# Altium schematic sheet PCB_Block_diagram.SchDoc
size A4; SheetNumber: 1; SheetTotal: 9
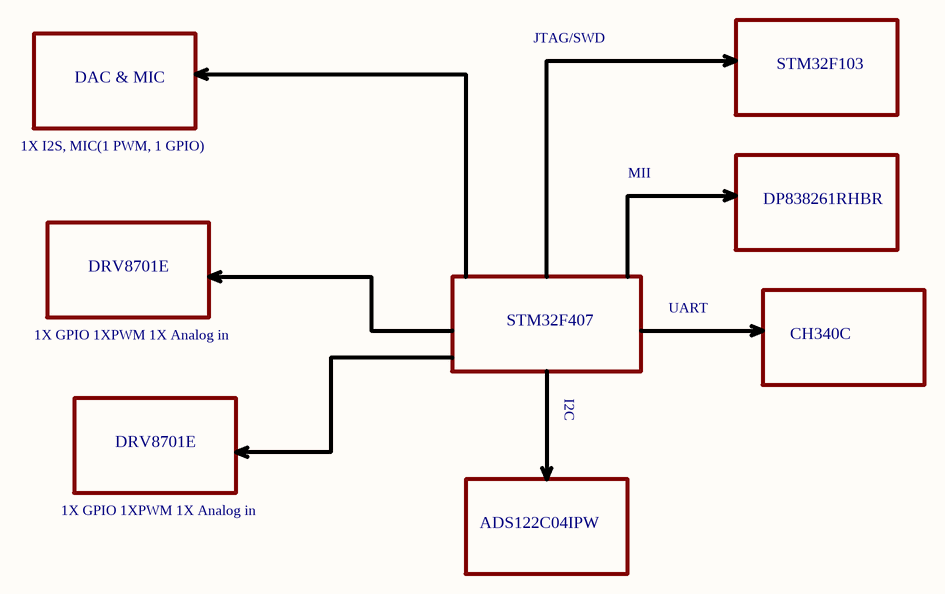
[diagram p0: PCB_Block_diagram.SchDoc]

## Notes on the sheet
- JTAG/SWD
- DAC & MIC
- STM32F103
- 1X I2S, MIC(1 PWM, 1 GPIO)
- MII
- DP838261RHBR
- DRV8701E
- STM32F407
- UART
- 1X GPIO 1XPWM 1X Analog in
- I2C
- CH340C
- ADS122C04IPW